# Altium schematic sheet CLOCKANDSWITCH.SchDoc
size A4; PageSetup: Record=PageOptions|CenterHorizontal=True|CenterVertical=True|PrintScale=1.00|XCorrection=1.00|YCorrection=1.00|PrintKind=2|BorderSize=5000000|LeftOffset=0|BottomOffset=0|Orientation=2|PaperLength=1000|PaperWidth=1000|Scale=100|PaperSource=7|PrintQuality=-3|MediaType=1|DitherType=10|PrintScaleMode=1|PaperKind=A4|PaperIndex=9
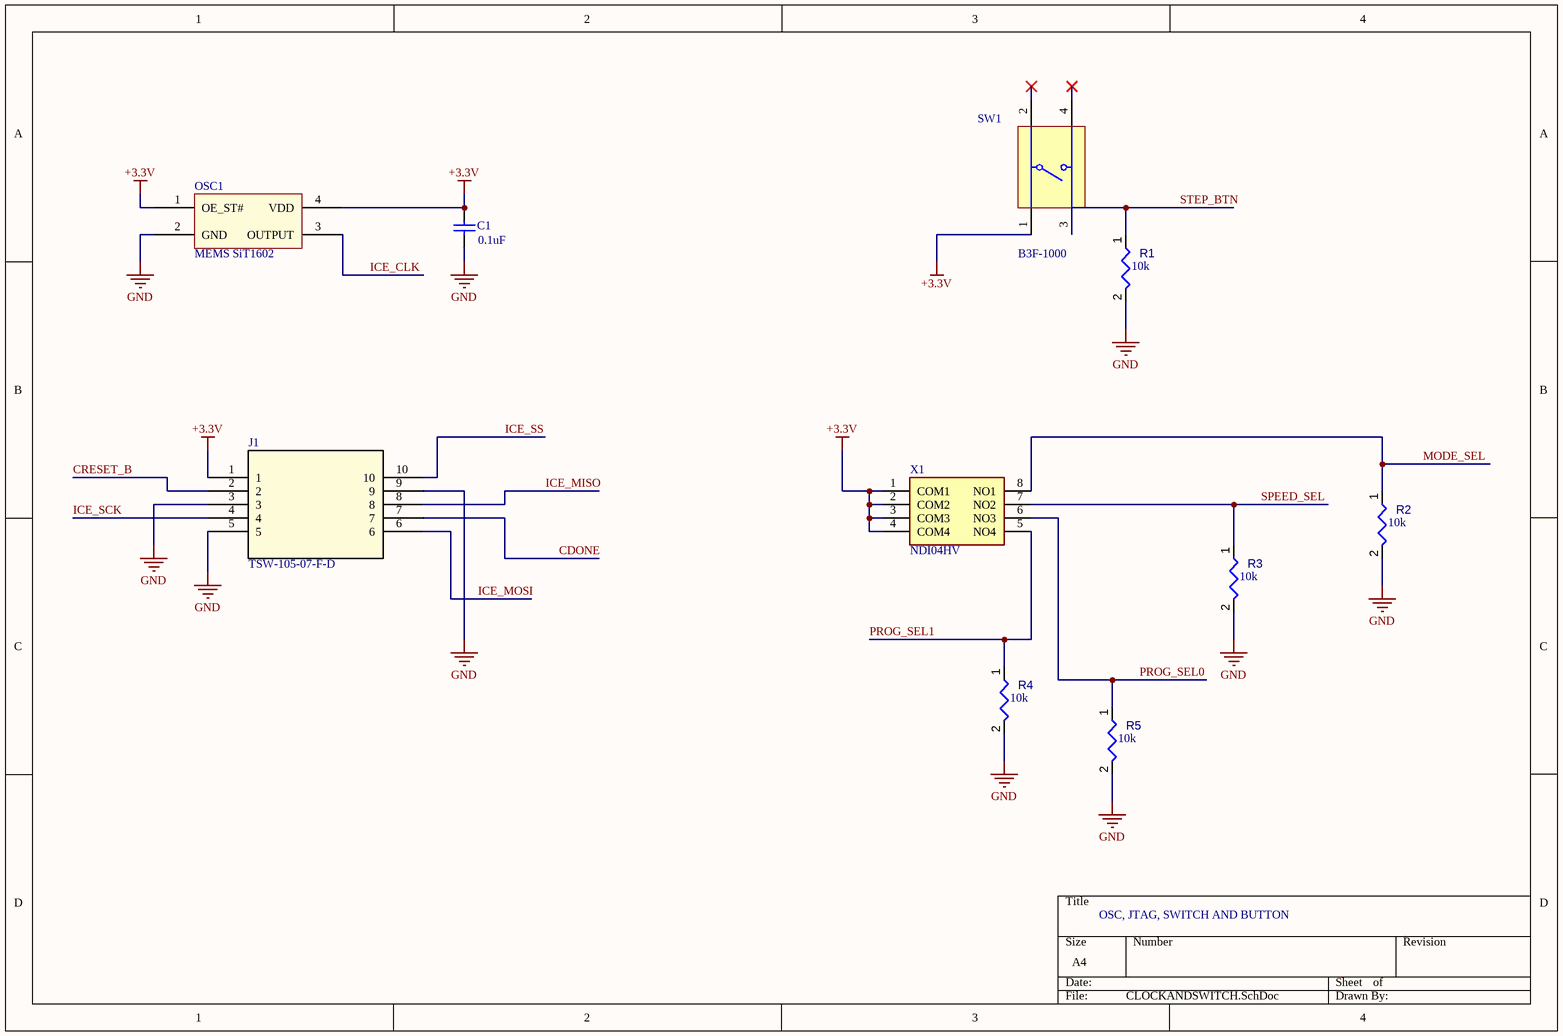
[diagram p0: CLOCKANDSWITCH.SchDoc]

## Parts
C1  value 0.1uF  [C0402]  (hidden comment: Cap Semi)
J1  TSW-105-07-F-D  [TSW-105-07-G-D_SAI]
OSC1  MEMS SiT1602  [oscMEMS1602]
R1  value 10k  [RESC2013X50X35ML15T15]  (hidden comment: Resistor 10k +/-1% 0805 125 mW)
R2  value 10k  [RESC2013X50X35ML15T15]  (hidden comment: Resistor 10k +/-1% 0805 125 mW)
R3  value 10k  [RESC2013X50X35ML15T15]  (hidden comment: Resistor 10k +/-1% 0805 125 mW)
R4  value 10k  [RESC2013X50X35ML15T15]  (hidden comment: Resistor 10k +/-1% 0805 125 mW)
R5  value 10k  [RESC2013X50X35ML15T15]  (hidden comment: Resistor 10k +/-1% 0805 125 mW)
SW1  B3F-1000  [OMRON-B3F-1000-4_V]
X1  NDI04HV  [NDI04HV]

## Nets
+3.3V: C1.2 J1.1 OSC1.1(OE_ST#) OSC1.4(VDD) SW1.1 X1.1(COM1) X1.2(COM2) X1.3(COM3) X1.4(COM4)
GND: C1.1 J1.3 J1.5 J1.9 OSC1.2(GND) R1.2 R2.2 R3.2 R4.2 R5.2
CDONE: J1.7
CRESET_B: J1.2
ICE_CLK: OSC1.3(OUTPUT)
ICE_MISO: J1.8
ICE_MOSI: J1.6
ICE_SCK: J1.4
ICE_SS: J1.10
MODE_SEL: R2.1 X1.8(NO1)
PROG_SEL0: R5.1 X1.6(NO3)
PROG_SEL1: R4.1 X1.5(NO4)
SPEED_SEL: R3.1 X1.7(NO2)
STEP_BTN: R1.1 SW1.3

Not connected (* = marked no-connect by the designer): SW1 2* 4*

## Notes on the sheet
- OSC, JTAG, SWITCH AND BUTTON

## Library data of the parts
C1 = Cap Semi: Capacitor (Semiconductor SIM Model); Manufacturer: Samsung Electro-Mechanics; Manufacturer Part Number: CL05B104KA5NNNC; Tolerance: ±10%; Voltage - Rated: 25V; Temperature Coefficient: X7R; Notification: Current market demand for these product types have resulted in fluctuating and extending lead times. Lead times may differ.; Published: 8-Jun-2000; LatestRevisionDate: 29-May-2009; LatestRevisionNote: IPC-7351 Footprint Added.; PackageReference: C1206; Publisher: Altium Limited; PackageDescription: Chip Capacitor; Supplier 1: Digi-Key; Supplier Part Number 1: 1276-6720-1-ND; RoHS: RoHS Compliant; Category: Capacitors; Stock 1: 0; Pricing 1: 1=0.1, 10=0.071, 100=0.0317, 500=0.02262, 1000=0.01777, 2500=0.01616, 5000=0.01486 (USD); Packaging: Cut Tape (CT); Part Status: Active; Operating Temperature: -55°C ~ 125°C; Features: -; Ratings: -; Applications: General Purpose; Mounting Type: Surface Mount, MLCC; Package / Case: 0402 (1005 Metric); Size / Dimension: 0.039" L x 0.020" W (1.00mm x 0.50mm); Height - Seated (Max): -; Thickness (Max): 0.022" (0.55mm); Lead Spacing: -; Lead Style: -; ComponentLink1URL: http://www.samsungsem.com/kr/support/product-search/mlcc/CL05B104KA5NNNC.jsp; ComponentLink1Description: http://www.samsungsem.com/kr/support/product-search/mlcc/CL05B104KA5NNNC.jsp
J1 = CMP-007-000000-1: Description; Manufacturer_Name: Samtec Inc; Source: TSW-105-07-F-D.SchLib; Design Item ID: TSW-105-07-F-D; Manufacturer_Part_Number: TSW-105-07-F-D; Copyright: Copyright (C) 2025 Ultra Librarian. All rights reserved.; Type: Type; RefDes: RefDes
OSC1 = SIT1602AC-13-33E-12.000000G: MEMS OSC XO 12.0000MHZ LVCMOS; Manufacturer: SiTIME; Function: Enable/Disable; Voltage - Supply: 3.3V; Frequency Stability: ±50ppm; Current - Supply (Max): 4.5mA; Current - Supply (Disable) (Max): 4mA; Supplier 1: Digi-Key; Manufacturer Part Number: SIT1602AC-13-33E-12.000000G; RoHS: RoHS Compliant; Category: Crystals, Oscillators, Resonators; Packaging: Cut Tape (CT); Part Status: Not For New Designs; Base Resonator: MEMS; Type: XO (Standard); Output: LVCMOS; Operating Temperature: -20°C ~ 70°C; Ratings: -; Mounting Type: Surface Mount; Package / Case: 4-SMD, No Lead; Size / Dimension: 0.098" L x 0.079" W (2.50mm x 2.00mm); Height - Seated (Max): 0.032" (0.80mm); ComponentLink1URL: https://media.digikey.com/pdf/Data%20Sheets/SiTime%20PDFs/SIT1602A.pdf; ComponentLink1Description: https://media.digikey.com/pdf/Data%20Sheets/SiTime%20PDFs/SIT1602A.pdf; Supplier Part Number 1: 1473-1051-1-ND; Pricing 1: 1=1.26, 10=1.118, 50=1.045, 100=0.9236 (USD)
R1-R5 = CMP-009-00018-5: Chip Resistor, 10 KOhm, +/- 1%, 125 mW, -55 to 155 degC, 0805 (2012 Metric); Power: 125mW; Voltage Rating: 150V; Tolerance: 1%; Pins: 2; Min Operating Temperature: -55°C; Case/Package: 0805; Max Operating Temperature: 155°C; RoHS Compliant: True; Mounting Technology: SM
SW1 = CMP-011-00004-2: Tactile Switch, SPST-NO, 0.05 A, 24 V, -25 to 70 degC, 4-Pin THD, RoHS, Bulk; Manufacturer: Omron Electronic Components; Throw Configuration: SPST; Max Contact Resistance: 100mohm; Resistance: 0.1Ohm; Max Current Rating: 50mA; Voltage Rating: 24V; Operating Force: 100gf; Datasheet Version: Jan-15; Case/Package: B3F-1000; Packaging: Bulk; Package Description: 4-Pin Through Hole Device, Body 6 x 6 mm; Manufacturer URL: http://www.omron.com/; Package Reference: B3F-1000; Contact Plating: Gold; Contact Current Rating: 50mA; RoHS Compliant: True; Contact Material: Gold; Mounting Technology: TH; Max Operating Temperature: 70°C; Min Operating Temperature: -25°C; Package Quantity: 1500; Datasheet URL: http://www.omron.com/ecb/products/pdf/en-b3f.pdf; Voltage Rating (DC): 24V; Pins: 4; Current Rating: 50mA; Max Voltage Rating (DC): 24V
X1 = CMP-014-000000-1: Dip Switch SPST 4 Position Through Hole Slide (Standard) Actuator 25mA 24VDC; Manufacturer_Name: Apem; Geometry.Height: 5mm; Mouser Part Number: 642-NDI04HV; Source: NDI04HV.SchLib; Mouser Price/Stock: https://www.mouser.co.uk/ProductDetail/Apem/NDI04HV/?qs=4pzlT8jjbheYf%2FxKjHex%252BQ%3D%3D; Datasheet Link: https://www.mouser.ca/datasheet/2/26/NDI_DM_DIPS-276092.pdf; Design Item ID: NDI04HV; Manufacturer_Part_Number: NDI04HV